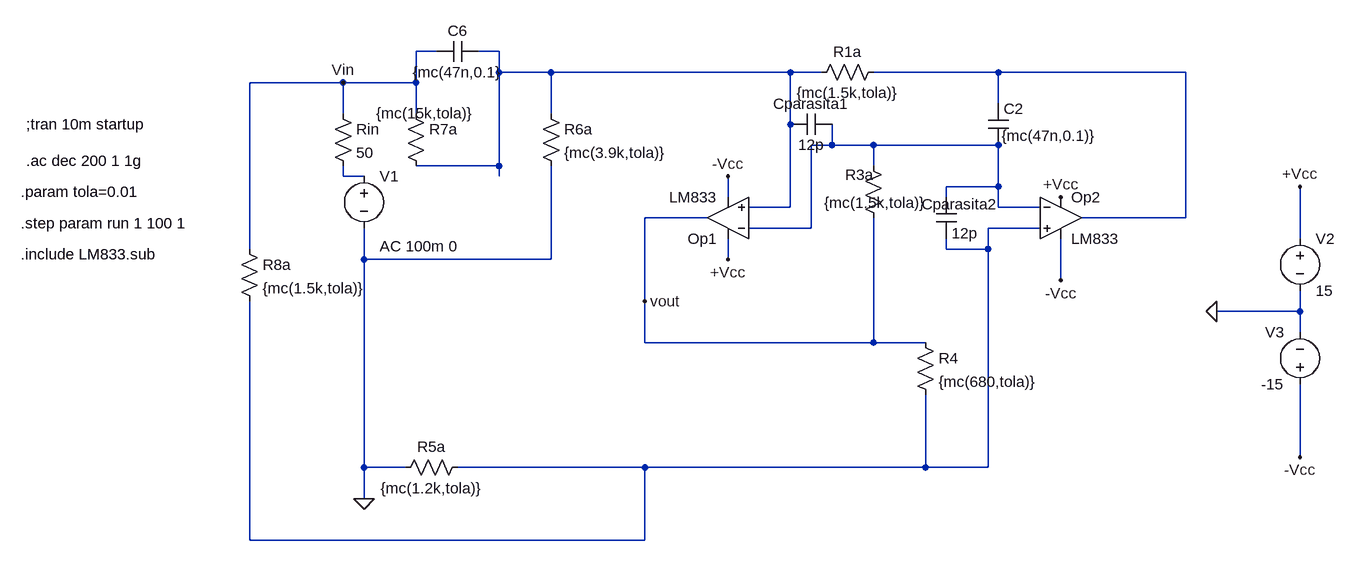
[diagram p0: schematic GIC-sim.asc]
GIC-sim.asc, the LTspice schematic file:
Version 4
SHEET 1 1620 980
WIRE -160 224 -192 224
WIRE -64 224 -96 224
WIRE -64 256 -64 224
WIRE 16 256 -64 256
WIRE 384 256 16 256
WIRE 432 256 384 256
WIRE 704 256 512 256
WIRE 992 256 704 256
WIRE -304 272 -448 272
WIRE -192 272 -192 224
WIRE -192 272 -304 272
WIRE 704 304 704 256
WIRE -304 320 -304 272
WIRE -192 320 -192 272
WIRE 16 320 16 256
WIRE 384 336 384 256
WIRE 448 368 448 336
WIRE 448 368 416 368
WIRE 512 368 448 368
WIRE 704 368 512 368
WIRE -64 400 -64 256
WIRE -64 400 -192 400
WIRE 512 400 512 368
WIRE -304 416 -304 400
WIRE -272 416 -304 416
WIRE -64 416 -64 400
WIRE 704 432 704 368
WIRE 704 432 624 432
WIRE 288 448 288 416
WIRE 624 448 624 432
WIRE 384 464 384 336
WIRE 384 464 320 464
WIRE 704 464 704 432
WIRE 768 464 704 464
WIRE 256 480 160 480
WIRE 992 480 992 256
WIRE 992 480 832 480
WIRE 416 496 416 368
WIRE 416 496 320 496
WIRE 768 496 688 496
WIRE 1168 512 1168 432
WIRE -448 528 -448 272
WIRE 624 528 624 512
WIRE 688 528 688 496
WIRE 688 528 624 528
WIRE -272 544 -272 496
WIRE 16 544 16 400
WIRE 16 544 -272 544
WIRE 288 544 288 512
WIRE 800 576 800 512
WIRE 160 608 160 480
WIRE 1168 624 1168 592
WIRE 1168 624 1040 624
WIRE 1168 656 1168 624
WIRE 160 672 160 608
WIRE 512 672 512 480
WIRE 512 672 160 672
WIRE 592 672 512 672
WIRE 1168 848 1168 736
WIRE -272 864 -272 544
WIRE -208 864 -272 864
WIRE 160 864 -128 864
WIRE 592 864 592 752
WIRE 592 864 160 864
WIRE 688 864 688 528
WIRE 688 864 592 864
WIRE -272 912 -272 864
WIRE -448 976 -448 608
WIRE 160 976 160 864
WIRE 160 976 -448 976
FLAG -272 912 0
FLAG 160 608 vout
FLAG 288 544 +Vcc
FLAG 288 416 -Vcc
FLAG 800 448 +Vcc
FLAG 800 576 -Vcc
FLAG 1040 624 0
FLAG 1168 432 +Vcc
FLAG 1168 848 -Vcc
FLAG -304 272 Vin
SYMBOL res 576 656 R0
SYMATTR InstName R4
SYMATTR Value {mc(680,tola)}
SYMBOL cap 688 304 R0
WINDOW 3 21 50 Left 2
SYMATTR Value {mc(47n,0.1)}
SYMATTR InstName C2
SYMBOL cap -96 208 R90
WINDOW 0 0 32 VBottom 2
WINDOW 3 32 32 VTop 2
SYMATTR InstName C6
SYMATTR Value {mc(47n,0.1}
SYMBOL res -464 512 R0
SYMATTR InstName R8a
SYMATTR Value {mc(1.5k,tola)}
SYMBOL res 528 240 R90
WINDOW 0 0 56 VBottom 2
WINDOW 3 32 56 VTop 2
SYMATTR InstName R1a
SYMATTR Value {mc(1.5k,tola)}
SYMBOL res 496 384 R0
WINDOW 0 -28 30 Left 2
WINDOW 3 -60 73 Left 2
SYMATTR InstName R3a
SYMATTR Value {mc(1.5k,tola)}
SYMBOL res -112 848 R90
WINDOW 0 0 56 VBottom 2
WINDOW 3 32 56 VTop 2
SYMATTR InstName R5a
SYMATTR Value {mc(1.2k,tola)}
SYMBOL res 0 304 R0
SYMATTR InstName R6a
SYMATTR Value {mc(3.9k,tola)}
SYMBOL res -208 304 R0
WINDOW 3 -45 15 Left 2
SYMATTR Value {mc(15k,tola)}
SYMATTR InstName R7a
SYMBOL Opamps\\opamp2 288 544 R180
SYMATTR InstName Op1
SYMATTR Value LM833
SYMBOL Opamps\\opamp2 800 416 R0
SYMATTR InstName Op2
SYMATTR Value LM833
SYMBOL voltage 1168 496 R0
WINDOW 123 0 0 Left 2
WINDOW 39 0 0 Left 2
SYMATTR InstName V2
SYMATTR Value 15
SYMBOL voltage 1168 752 R180
WINDOW 0 24 96 Left 2
WINDOW 3 24 16 Left 2
WINDOW 123 0 0 Left 2
WINDOW 39 0 0 Left 2
SYMATTR InstName V3
SYMATTR Value -15
SYMBOL cap 448 320 R90
WINDOW 0 0 32 VBottom 2
WINDOW 3 32 32 VTop 2
SYMATTR InstName Cparasita1
SYMATTR Value 12p
SYMBOL cap 608 448 R0
WINDOW 0 -22 11 Left 2
SYMATTR InstName Cparasita2
SYMATTR Value 12p
SYMBOL voltage -272 400 R0
WINDOW 123 24 124 Left 2
SYMATTR InstName V1
SYMATTR Value ""
SYMATTR Value2 AC 100m 0
SYMBOL res -320 304 R0
SYMATTR InstName Rin
SYMATTR Value 50
TEXT -792 392 Left 2 !.ac dec 200 1 1g
TEXT -800 440 Left 2 !.param tola=0.01
TEXT -800 488 Left 2 !.step param run 1 100 1
TEXT -800 536 Left 2 !.include LM833.sub
TEXT -792 336 Left 2 !;tran 10m startup

The netlist it stands for:
* GIC-sim.asc
R4 vout N005 {mc(680,tola)}
C2 N002 N003 {mc(47n,0.1)}
C6 N001 Vin {mc(47n,0.1}
R8a Vin N005 {mc(1.5k,tola)}
R1a N002 N001 {mc(1.5k,tola)}
R3a N003 vout {mc(1.5k,tola)}
R5a N005 0 {mc(1.2k,tola)}
R6a N001 0 {mc(3.9k,tola)}
R7a Vin N001 {mc(15k,tola)}
XOp1 N001 N003 +Vcc -Vcc vout LM833  ; pins In+ In- V+ V- OUT
XOp2 N005 N003 +Vcc -Vcc N002 LM833  ; pins In+ In- V+ V- OUT
V2 +Vcc 0 15
V3 -Vcc 0 -15
Cparasita1 N003 N001 12p
Cparasita2 N003 N005 12p
V1 N004 0 AC 100m 0
Rin Vin N004 50
.ac dec 200 1 1g
.param tola=0.01
.step param run 1 100 1
.include LM833.sub
;tran 10m startup
.backanno
.end